# Altium schematic sheet SNAKE_FYP.SchDoc
size A3; SheetNumber: 1; SheetTotal: 1
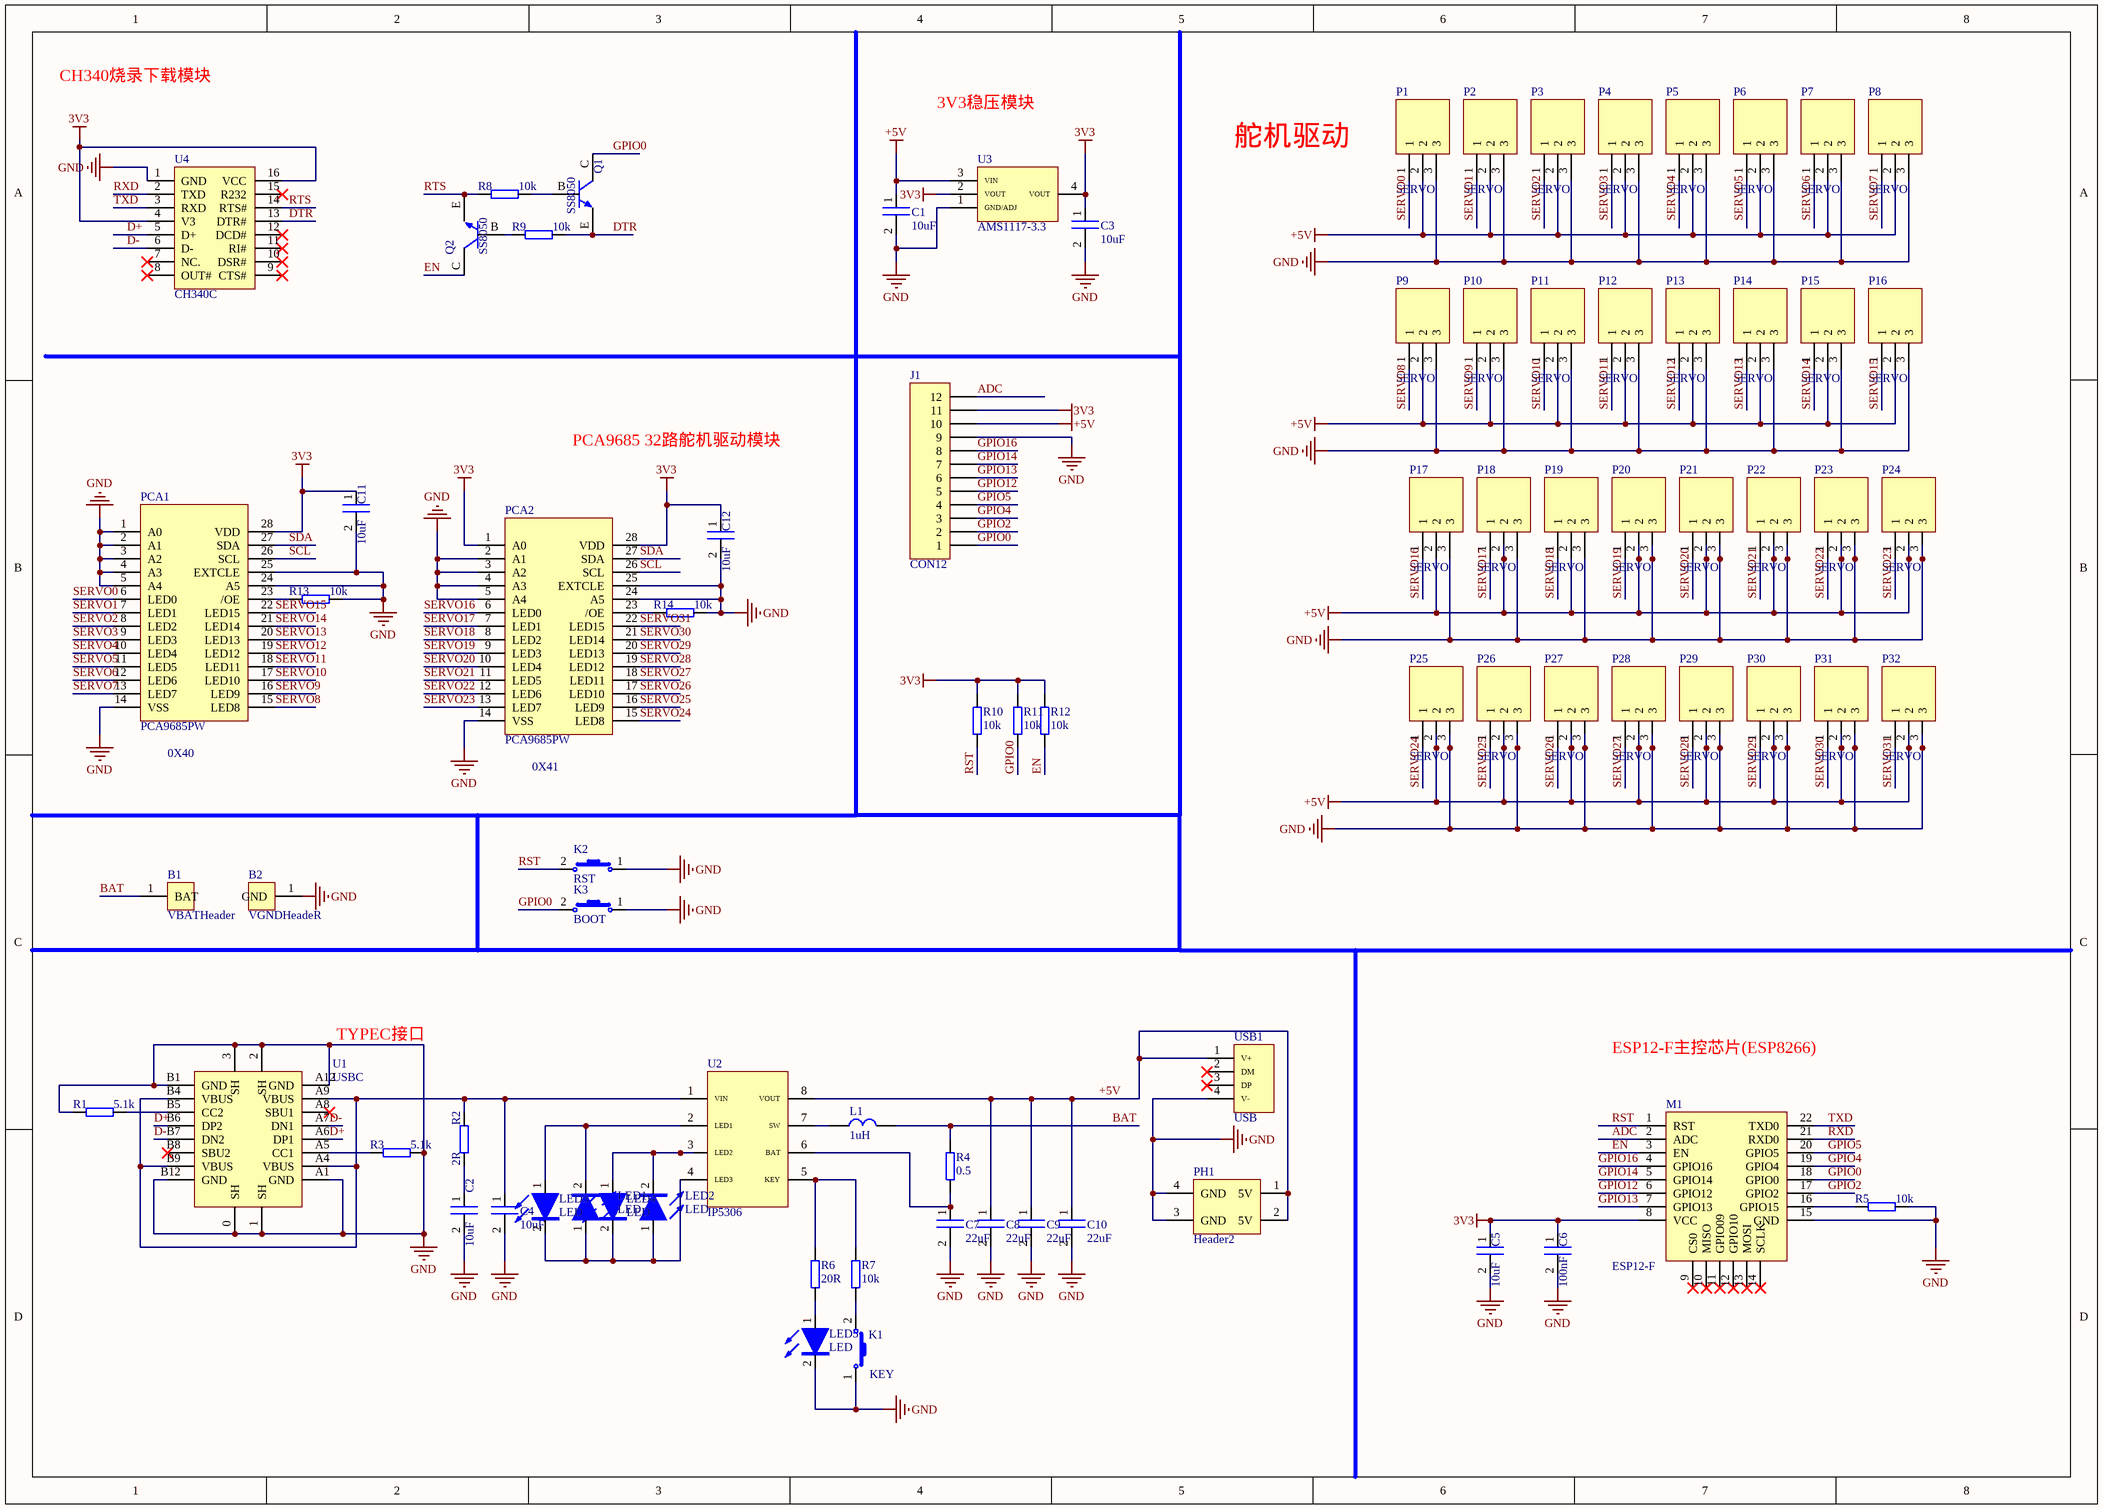
[diagram p0: SNAKE_FYP.SchDoc]

## Parts
B1  VBATHeader  [18650VBAT]
B2  VGNDHeadeR  [18650GND]
C1  10uF  [Cap-0603]
C2  10uF  [Cap-0603]
C3  10uF  [Cap-0603]
C4  10uF  [Cap-0603]
C5  10uF  [Cap-0603]
C6  100nF  [Cap-0603]
C7  22uF  [Cap-0603]
C8  22uF  [Cap-0603]
C9  22uF  [Cap-0603]
C10  22uF  [Cap-0603]
C11  10uF  [Cap-0603]
C12  10uF  [Cap-0603]
J1  CON12  [HDR2X6]
K1  KEY  [TSW SMD-3*6*2.5(Button)]
K2  RST  [TSW SMD-3*6*2.5(Button)]
K3  BOOT  [TSW SMD-3*6*2.5(Button)]
L1  1uH  [CDRH3D16_4.2*1.8]
LED1  LED  [LED-0805]
LED2  LED  [LED-0805]
LED3  LED  [LED-0805]
LED4  LED  [LED-0805]
LED5  LED  [LED-0805]
M1  ESP12-F  [ESP-12F]
P1  SERVO  [SERVOHEADER]
P2  SERVO  [SERVOHEADER]
P3  SERVO  [SERVOHEADER]
P4  SERVO  [SERVOHEADER]
P5  SERVO  [SERVOHEADER]
P6  SERVO  [SERVOHEADER]
P7  SERVO  [SERVOHEADER]
P8  SERVO  [SERVOHEADER]
P9  SERVO  [SERVOHEADER]
P10  SERVO  [SERVOHEADER]
P11  SERVO  [SERVOHEADER]
P12  SERVO  [SERVOHEADER]
P13  SERVO  [SERVOHEADER]
P14  SERVO  [SERVOHEADER]
P15  SERVO  [SERVOHEADER]
P16  SERVO  [SERVOHEADER]
P17  SERVO  [SERVOHEADER]
P18  SERVO  [SERVOHEADER]
P19  SERVO  [SERVOHEADER]
P20  SERVO  [SERVOHEADER]
P21  SERVO  [SERVOHEADER]
P22  SERVO  [SERVOHEADER]
P23  SERVO  [SERVOHEADER]
P24  SERVO  [SERVOHEADER]
P25  SERVO  [SERVOHEADER]
P26  SERVO  [SERVOHEADER]
P27  SERVO  [SERVOHEADER]
P28  SERVO  [SERVOHEADER]
P29  SERVO  [SERVOHEADER]
P30  SERVO  [SERVOHEADER]
P31  SERVO  [SERVOHEADER]
P32  SERVO  [SERVOHEADER]
PCA1  PCA9685PW  [PCA9685TSOP28]
PCA2  PCA9685PW  [PCA9685TSOP28]
PH1  Header2  [HDR2X2]
Q1  SS8050  [SOT-23_BEC(SS8050)]
Q2  SS8050  [SOT-23_BEC(SS8050)]
R1  5.1k  [0603_RES]
R2  2R  [0603_RES]
R3  5.1k  [0603_RES]
R4  0.5  [0603_RES]
R5  10k  [0603_RES]
R6  20R  [0603_RES]
R7  10k  [0603_RES]
R8  10k  [0603_RES]
R9  10k  [0603_RES]
R10  10k  [0603_RES]
R11  10k  [0603_RES]
R12  10k  [0603_RES]
R13  10k  [0603_RES]
R14  10k  [0603_RES]
U1  USBC  [TYPEC]
U2  IP5306  [ESOP_IP5306]
U3  AMS1117-3.3  [SOT229P700X180-4N(AMS1117-3.3)]
U4  CH340C  [SO016_CH340]
USB1  USB  [TypeA]

## Nets
3V3: C3.1 C5.1 C6.1 C11.1 C12.1 J1.11 M1.8(VCC) PCA1.28(VDD) PCA2.1(A0) PCA2.28(VDD) R10.1 R11.1 R12.1 U3.2(VOUT) U3.4(VOUT) U4.4(V3) U4.16(VCC)
+5V: C1.1 C8.1 C9.1 C10.1 J1.10 P1.2 P2.2 P3.2 P4.2 P5.2 P6.2 P7.2 P8.2 P9.2 P10.2 P11.2 P12.2 P13.2 P14.2 P15.2 P16.2 P17.2 P18.2 P19.2 P20.2 P21.2 P22.2 P23.2 P24.2 P25.2 P26.2 P27.2 P28.2 P29.2 P30.2 P31.2 P32.2 PH1.1(5V) PH1.2(5V) U2.8(VOUT) U3.3(VIN) USB1.1(V+)
GND: B2.1(GND) C1.2 C2.2 C3.2 C4.2 C5.2 C6.2 C7.2 C8.2 C9.2 C10.2 C11.2 C12.2 J1.9 K1.1 K2.1 K3.1 LED5.2 M1.15(GND) P1.3 P2.3 P3.3 P4.3 P5.3 P6.3 P7.3 P8.3 P9.3 P10.3 P11.3 P12.3 P13.3 P14.3 P15.3 P16.3 P17.3 P18.3 P19.3 P20.3 P21.3 P22.3 P23.3 P24.3 P25.3 P26.3 P27.3 P28.3 P29.3 P30.3 P31.3 P32.3 PCA1.1(A0) PCA1.2(A1) PCA1.3(A2) PCA1.4(A3) PCA1.5(A4) PCA1.14(VSS) PCA1.24(A5) PCA1.25(EXTCLE) PCA2.2(A1) PCA2.3(A2) PCA2.4(A3) PCA2.5(A4) PCA2.14(VSS) PCA2.24(A5) PCA2.25(EXTCLE) PH1.3(GND) PH1.4(GND) R1.1 R3.2 R5.2 R13.2 R14.2 U1.0(SH) U1.1(SH) U1.2(SH) U1.3(SH) U1.A1(GND) U1.A12(GND) U1.B1(GND) U1.B12(GND) U3.1(GND/ADJ) U4.1(GND) USB1.4(V-)
ADC: J1.12 M1.2(ADC)
BAT: B1.1(BAT) L1.2 R4.2
D+: U1.A6(DP1) U1.B6(DP2) U4.5(D+)
D-: U1.A7(DN1) U1.B7(DN2) U4.6(D-)
DTR: Q1.E R9.2 U4.13(DTR#)
EN: M1.3(EN) Q2.C R12.2
GPIO0: J1.1 K3.2 M1.18(GPIO0) Q1.C R11.2
GPIO2: J1.2 M1.17(GPIO2)
GPIO4: J1.3 M1.19(GPIO4)
GPIO5: J1.4 M1.20(GPIO5)
GPIO12: J1.5 M1.6(GPIO12)
GPIO13: J1.6 M1.7(GPIO13)
GPIO14: J1.7 M1.5(GPIO14)
GPIO16: J1.8 M1.4(GPIO16)
RST: K2.2 M1.1(RST) R10.2
RTS: Q2.E R8.1 U4.14(RTS#)
RXD: M1.21(RXD0) U4.2(TXD)
SCL: PCA1.26(SCL) PCA2.26(SCL)
SDA: PCA1.27(SDA) PCA2.27(SDA)
SERVO0: P1.1 PCA1.6(LED0)
SERVO1: P2.1 PCA1.7(LED1)
SERVO2: P3.1 PCA1.8(LED2)
SERVO3: P4.1 PCA1.9(LED3)
SERVO4: P5.1 PCA1.10(LED4)
SERVO5: P6.1 PCA1.11(LED5)
SERVO6: P7.1 PCA1.12(LED6)
SERVO7: P8.1 PCA1.13(LED7)
SERVO8: P9.1 PCA1.15(LED8)
SERVO9: P10.1 PCA1.16(LED9)
SERVO10: P11.1 PCA1.17(LED10)
SERVO11: P12.1 PCA1.18(LED11)
SERVO12: P13.1 PCA1.19(LED12)
SERVO13: P14.1 PCA1.20(LED13)
SERVO14: P15.1 PCA1.21(LED14)
SERVO15: P16.1 PCA1.22(LED15)
SERVO16: P17.1 PCA2.6(LED0)
SERVO17: P18.1 PCA2.7(LED1)
SERVO18: P19.1 PCA2.8(LED2)
SERVO19: P20.1 PCA2.9(LED3)
SERVO20: P21.1 PCA2.10(LED4)
SERVO21: P22.1 PCA2.11(LED5)
SERVO22: P23.1 PCA2.12(LED6)
SERVO23: P24.1 PCA2.13(LED7)
SERVO24: P25.1 PCA2.15(LED8)
SERVO25: P26.1 PCA2.16(LED9)
SERVO26: P27.1 PCA2.17(LED10)
SERVO27: P28.1 PCA2.18(LED11)
SERVO28: P29.1 PCA2.19(LED12)
SERVO29: P30.1 PCA2.20(LED13)
SERVO30: P31.1 PCA2.21(LED14)
SERVO31: P32.1 PCA2.22(LED15)
TXD: M1.22(TXD0) U4.3(RXD)
NetC2_1: C2.1 R2.1
NetC4_1: C4.1 R2.2 U1.A4(VBUS) U1.A9(VBUS) U1.B4(VBUS) U1.B9(VBUS) U2.1(VIN)
NetC7_1: C7.1 R4.1 U2.6(BAT)
NetK1_2: K1.2 R7.2
NetL1_1: L1.1 U2.7(SW)
NetLED1_1: LED1.1 LED2.1 LED3.2 LED4.2 U2.4(LED3)
NetLED1_2: LED1.2 LED3.1 U2.2(LED1)
NetLED2_2: LED2.2 LED4.1 U2.3(LED2)
NetLED5_1: LED5.1 R6.2
NetM1_16: M1.16(GPIO15) R5.1
NetPCA1_23: PCA1.23(/OE) R13.1
NetPCA2_23: PCA2.23(/OE) R14.1
NetQ1_B: Q1.B R8.2
NetQ2_B: Q2.B R9.1
NetR1_2: R1.2 U1.B5(CC2)
NetR3_1: R3.1 U1.A5(CC1)
NetR6_1: R6.1 R7.1 U2.5(KEY)

Not connected (* = marked no-connect by the designer): M1 9(CS0)* 10(MISO)* 11(GPIO09)* 12(GPIO10)* 13(MOSI)* 14(SCLK)*; U1 A8(SBU1)* B8(SBU2)*; U4 7(NC.)* 8(OUT#)* 9(CTS#)* 10(DSR#)* 11(RI#)* 12(DCD#)* 15(R232)*; USB1 2(DM)* 3(DP)*

## Notes on the sheet
- CH340烧录下载模块
- 3V3稳压模块
- 舵机驱动
- PCA9685 32路舵机驱动模块
- (near PCA1) 0X40
- (near PCA2) 0X41
- (near U1) TYPEC接口
- ESP12-F主控芯片(ESP8266)

## Library data of the parts
C1-C12 = CAP: 电容
J1 = CON12: Connector
K1-K3 = RST: 按键
L1 = INDUCTOR: 电感
R1-R14 = RES: 电阻
U2 = IP5306: 升压、降压和锂电池充电管理芯片
U4 = CH340